# Altium project DAPLINK.PrjPCB
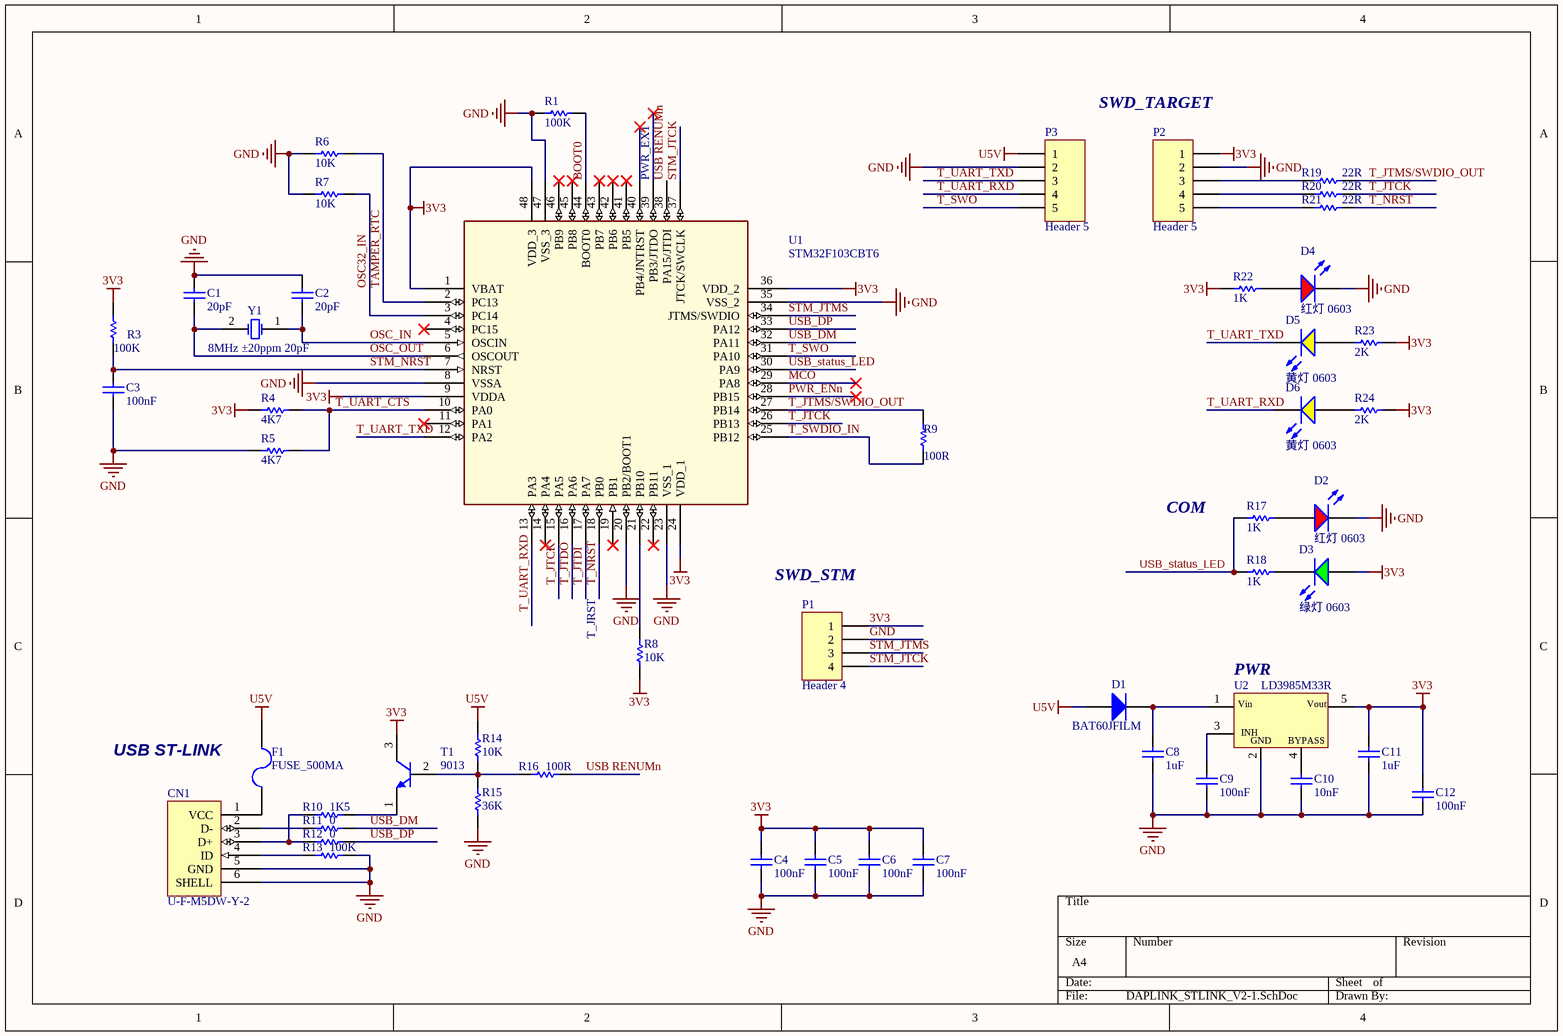
[diagram p0: DAPLINK_STLINK_V2-1.SchDoc]
1 sheet, 50 parts. Net scope: global (net labels, ports and power ports of the same name join across sheets).
Board file: DAPLINK_V0.1.PcbDoc

## Sheet DAPLINK_STLINK_V2-1.SchDoc
size A4

### Parts
C1  20pF  [0603_C]
C2  20pF  [0603_C]
C3  100nF  [0603_C]
C4  100nF  [0603_C]
C5  100nF  [0603_C]
C6  100nF  [0603_C]
C7  100nF  [0603_C]
C8  1uF  [0603_C]
C9  100nF  [0603_C]
C10  10nF  [0603_C]
C11  1uF  [0603_C]
C12  100nF  [0603_C]
CN1  U-F-M5DW-Y-2  [MICRO-USB]
D1  BAT60JFILM  [SOD-323]
D2  红灯 0603  [0603_LED_S1]
D3  绿灯 0603  [0603_LED_S1]
D4  红灯 0603  [0603_LED_S1]
D5  黄灯 0603  [0603_LED_S1]
D6  黄灯 0603  [0603_LED_S1]
F1  FUSE_500MA  [1206_C]
P1  Header 4  [HDR1X4]
P2  Header 5  [HDR2.54-M-WS-5P-2D]
P3  Header 5  [HDR2.54-M-WS-5P-2D]
R1  100K  [0603_C]
R3  100K  [0603_C]
R4  4K7  [0603_C]
R5  4K7  [0603_C]
R6  10K  [0603_C]
R7  10K  [0603_C]
R8  10K  [0603_C]
R9  100R  [0603_C]
R10  1K5  [0603_C]
R11  0  [0603_C]
R12  0  [0603_C]
R13  100K  [0603_C]
R14  10K  [0603_C]
R15  36K  [0603_C]
R16  100R  [0603_C]
R17  1K  [0603_C]
R18  1K  [0603_C]
R19  22R  [0603_C]
R20  22R  [0603_C]
R21  22R  [0603_C]
R22  1K  [0603_C]
R23  2K  [0603_C]
R24  2K  [0603_C]
T1  9013  [SOT-23(SOT-23-3)]
U1  STM32F103CBT6  [LQFP48_0R5_7x7]
U2  LD3985M33R  [SOT23-5L]
Y1  8MHz ±20ppm 20pF  [SMD-5032_2P]

### Nets
3V3: C4.1 C5.1 C6.1 C7.1 C11.1 C12.1 D3.A P1.1 P2.1 R3.2 R4.2 R8.2 R22.1 R23.1 R24.1 T1.3(C) U1.1(VBAT) U1.9(VDDA) U1.24(VDD_1) U1.36(VDD_2) U1.48(VDD_3) U2.5(Vout)
GND: C1.2 C2.2 C3.1 C4.2 C5.2 C6.2 C7.2 C8.2 C9.2 C10.2 C11.2 C12.2 CN1.5(GND) CN1.6(SHELL) D2.K D4.K P1.2 P2.2 P3.2 R1.1 R5.1 R6.2 R7.2 R13.1 R15.2 U1.8(VSSA) U1.20(PB2/BOOT1) U1.23(VSS_1) U1.35(VSS_2) U1.47(VSS_3) U2.2(GND)
U5V: D1.1(A) F1.2 P3.1 R14.1
BOOT0: R1.2 U1.44(BOOT0)
MCO: U1.29(PA8)
OSC32_IN: R7.1 U1.3(PC14)
OSC_IN: C2.1 U1.5(OSCIN) Y1.1(OSC1)
OSC_OUT: C1.1 U1.6(OSCOUT) Y1.2(OSC2)
PWR_ENn: U1.28(PB15)
STM_JTCK: P1.4 U1.37(JTCK/SWCLK)
STM_JTMS: P1.3 U1.34(JTMS/SWDIO)
STM_NRST: C3.2 R3.1 U1.7(NRST)
T_JTCK: R20.2 U1.15(PA5) U1.26(PB13)
T_JTDI: U1.17(PA7)
T_JTDO: U1.16(PA6)
T_JTMS/SWDIO_OUT: R9.2 R19.2 U1.27(PB14)
T_NRST: R21.2 U1.18(PB0)
T_SWDIO_IN: R9.1 U1.25(PB12)
T_SWO: P3.5 U1.31(PA10)
T_UART_CTS: R4.1 R5.2 U1.10(PA0)
T_UART_RXD: D6.K P3.4 U1.13(PA3)
T_UART_TXD: D5.K P3.3 U1.12(PA2)
TAMPER_RTC: R6.1 U1.2(PC13)
USB RENUMn: R16.1 U1.38(PA15/JTDI)
USB_DM: R11.1 U1.32(PA11)
USB_DP: R12.1 U1.33(PA12)
USB_status_LED: R17.1 R18.2 U1.30(PA9)
NetC8_1: C8.1 D1.2(K) U2.1(Vin)
NetC9_1: C9.1 U2.3(CE)
NetC10_1: C10.1 U2.4(BYPASS)
NetCN1_1: CN1.1(VCC) F1.1
NetCN1_2: CN1.2(D-) R11.2
NetCN1_3: CN1.3(D+) R10.2 R12.2
NetCN1_4: CN1.4(ID) R13.2
NetD2_A: D2.A R17.2
NetD3_K: D3.K R18.1
NetD4_A: D4.A R22.2
NetD5_A: D5.A R23.2
NetD6_A: D6.A R24.2
NetP2_3: P2.3 R19.1
NetP2_4: P2.4 R20.1
NetP2_5: P2.5 R21.1
NetR8_1: R8.1 U1.21(PB10)
NetR10_1: R10.1 T1.1(E)
NetR14_2: R14.2 R15.1 R16.2 T1.2(B)

Not connected (* = marked no-connect by the designer): U1 4(PC15)* 11(PA1)* 14(PA4)* 19(PB1)* 22(PB11)* 39(PB3/JTDO)* 40(PB4/JNTRST)* 41(PB5)* 42(PB6)* 43(PB7)* 45(PB8)* 46(PB9)*

### Notes on the sheet
- (near P2) SWD_TARGET
- (near U1) PWR_EXT
- COM
- (near P1) SWD_STM
- (near R8) T_JRST
- (near U2) PWR
- USB ST-LINK
- (in symbol LD3985M33R) INH

### Library data of the parts
C1 C2 = Cap: Capacitor  0603 20pF; Published: 8-Jun-2000; LatestRevisionDate: 17-Jul-2002; LatestRevisionNote: Re-released for DXP Platform.; PackageReference: RAD-0.3; Publisher: Altium Limited; PackageDescription: Radial Cap, Thru-Hole; 2 Leads; 0.3 in Pin Spacing
C3 = Cap: Capacitor  0603 100nF; Published: 8-Jun-2000; LatestRevisionDate: 17-Jul-2002; LatestRevisionNote: Re-released for DXP Platform.; PackageReference: RAD-0.3; Publisher: Altium Limited; PackageDescription: Radial Cap, Thru-Hole; 2 Leads; 0.3 in Pin Spacing
C4 C5 C12 = Cap: Capacitor  0603  100nF; Published: 8-Jun-2000; LatestRevisionDate: 17-Jul-2002; LatestRevisionNote: Re-released for DXP Platform.; PackageReference: RAD-0.3; Publisher: Altium Limited; PackageDescription: Radial Cap, Thru-Hole; 2 Leads; 0.3 in Pin Spacing
C6 C7 C9 = Cap: Capacitor 0603 100nF; Published: 8-Jun-2000; LatestRevisionDate: 17-Jul-2002; LatestRevisionNote: Re-released for DXP Platform.; PackageReference: RAD-0.3; Publisher: Altium Limited; PackageDescription: Radial Cap, Thru-Hole; 2 Leads; 0.3 in Pin Spacing
C8 C11 = Cap: Capacitor 0603 1uF; Published: 8-Jun-2000; LatestRevisionDate: 17-Jul-2002; LatestRevisionNote: Re-released for DXP Platform.; PackageReference: RAD-0.3; Publisher: Altium Limited; PackageDescription: Radial Cap, Thru-Hole; 2 Leads; 0.3 in Pin Spacing
C10 = Cap: Capacitor  0603  10nF; Published: 8-Jun-2000; LatestRevisionDate: 17-Jul-2002; LatestRevisionNote: Re-released for DXP Platform.; PackageReference: RAD-0.3; Publisher: Altium Limited; PackageDescription: Radial Cap, Thru-Hole; 2 Leads; 0.3 in Pin Spacing
CN1 = USB-MICRO-typeB connector_1: USB-Micro-typeB connector; Manuf_Part_1: 5075BMR-05-SM; Order: 5075BMR-05-SM; ECCN: ????
D1 = BAT60JFILM: Manuf_1: STM; Provided: ST; ECCN_US/EU: EAR99/NEC; Revision: July-2002: Re-released for DXP Platform.; Order: BAT60JFILM; Manuf_Part_1: BAT60JFILM; Distrib: ST
D2 D4 = 0603 红灯: 发光二极管; ComponentLink1Description: 供应商链接; ComponentLink1URL: http://www.szlcsc.com/product/details_2659.html; Package: 0603; Supplier: LC; SuppliersPartNumber: C2286
D3 = 0603 绿灯: 发光二极管; ComponentLink1Description: 供应商链接; ComponentLink1URL: http://www.szlcsc.com/product/details_73152.html; Package: 0603; Supplier: LC; SuppliersPartNumber: C72043
D5 D6 = 0603 黄灯: 发光二极管; ComponentLink1Description: 供应商链接; ComponentLink1URL: http://www.szlcsc.com/product/details_73147.html; Package: 0603; Supplier: LC; SuppliersPartNumber: C72038
F1 = Fuse 2: 自恢复保险丝_SMD1206_500ma; Published: 8-Jun-2000; LatestRevisionDate: 17-Jul-2002; LatestRevisionNote: Re-released for DXP Platform.; PackageReference: PIN-W2/E2.8; Publisher: Altium Limited; PackageDescription: Thru-Hole; 2 Leads
P1 = Header 4: Header, 4-Pin; LatestRevisionDate: 17-Jul-2002; LatestRevisionNote: Re-released for DXP Platform.; Publisher: Altium Limited
P2 P3 = Header 5: Header, 5-Pin; LatestRevisionDate: 17-Jul-2002; LatestRevisionNote: Re-released for DXP Platform.; Publisher: Altium Limited
R1 = Resistor_ST: Resistor 0603; Value: 10K
R3-R5 R9-R13 R15-R24 = Resistor_ST: Resistor  0603; Value: 10K
R6-R8 R14 = Resistor_ST: Resistor  0603; Value: 10K
T1 = NPN: NPN Bipolar Transistor; Code - JEDEC: TO-226-AA; Published: 8-Jun-2000; Revision: July-2002: Re-released for DXP Platform.; Publisher: Altium Limited
U1 = STM32F103CBT6: Medium-density performance line ARM-based 32-bit MCU with 128KB Flash; Manuf_Part_1: STM32F103C8T6; Manuf_1: STM; Ref St: 9175981; Provided: ST; ECCN_US/EU: 3A991A2/NEC; Footprint: QFP48 7X7; Distrib: ST; Order: STM32F103C8T6
U2 = LD3985M33R: Ultra low drop-low noise BiCMOS voltage, regulators low ESR capacitors compatible; Manuf_1: STM; Provided: ST; Ref St: 9176161; ECCN_US/EU: EAR99/NEC; Manuf_Part_1: LD3985M33R; Distrib: ST; Order: LD3985M33R
Y1 = SMD-5032_2P 8MHz 20ppm 20pF: 贴片晶振; ComponentLink1Description: 供应商链接; ComponentLink1URL: http://www.szlcsc.com/product/details_117214.html; Package: SMD-5032_2P; Supplier: LC; SuppliersPartNumber: C115962